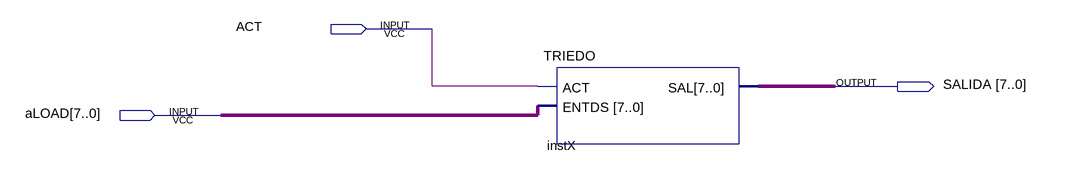
[diagram p0: schematic sheet]
// Quartus schematic LOAD.bdf as structural Verilog: 1 symbols, 3 pins
module LOAD (
  input  ACT,
  input  [7:0] aLOAD,
  output [7:0] SALIDA
);

  TRIEDO instX (.ACT(ACT), .ENTDS(aLOAD), .SAL(SALIDA));
endmodule
